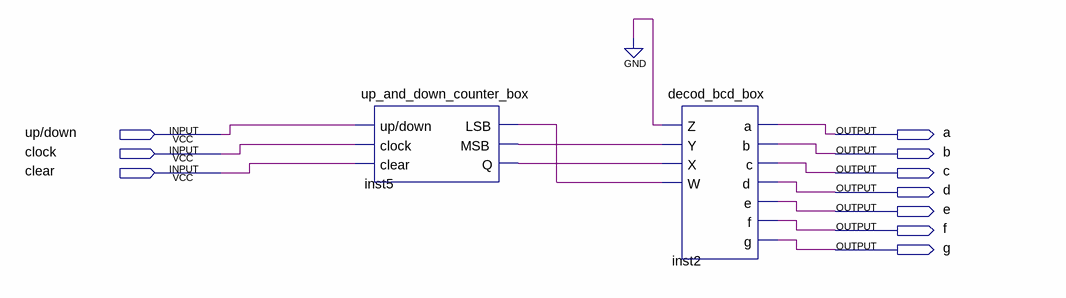
[diagram p0: schematic sheet]
// Quartus schematic up_and_down_counter.bdf as structural Verilog: 2 symbols, 10 pins
module up_and_down_counter (
  input  \up/down ,
  input  clock,
  input  clear,
  output a,
  output b,
  output c,
  output d,
  output e,
  output f,
  output g
);

  wire inst5_lsb, inst5_msb, inst5_q;

  up_and_down_counter_box inst5 (
    .\up/down (\up/down ), .clock(clock), .clear(clear), .LSB(inst5_lsb), .MSB(inst5_msb), .Q(inst5_q));
  decod_bcd_box inst2 (
    .Z(1'b0), .Y(inst5_msb), .X(inst5_q), .W(inst5_lsb), .a(a), .b(b), .c(c), .d(d), .e(e), .f(f), .g(g));
endmodule
